# EAGLE design PartiBadge-v3 (EAGLE 9.1.3)
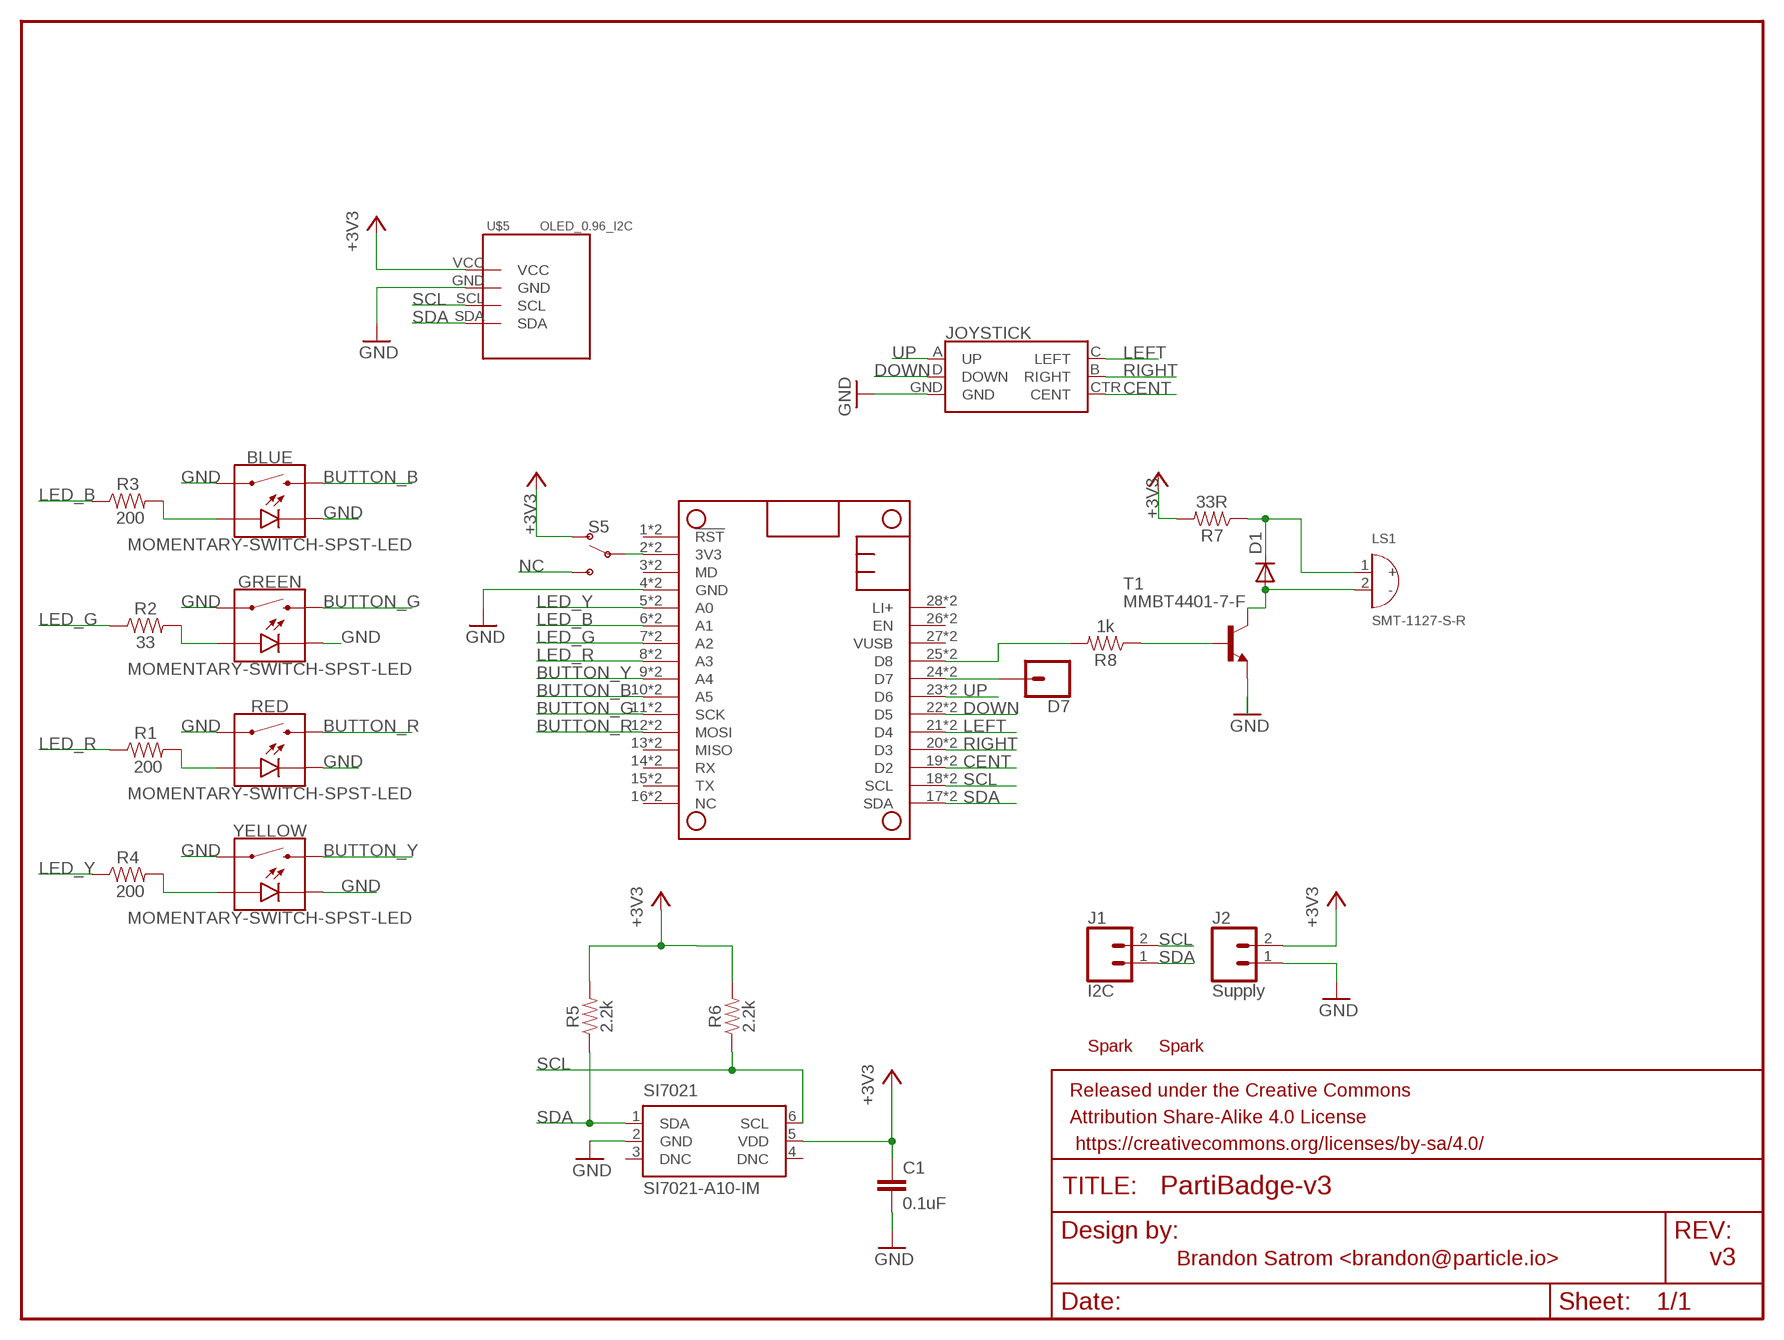
[diagram p0: schematic, sheet 1]

## Parts
BLUE  MOMENTARY-SWITCH-SPST-LED  MOMENTARY-SWITCH-SPST-LED-PTH-12MM-KIT  [TACTILE_SWITCH_LED_PTH_12MM_KIT]
C1  0.1uF  0.1UF-0603-25V-(+80/-20%)  [0603]
D1  DIODE-SOD323-W  [SOD323-W]
D7  CONN_01  [1X01]
GREEN  MOMENTARY-SWITCH-SPST-LED  MOMENTARY-SWITCH-SPST-LED-PTH-12MM-KIT  [TACTILE_SWITCH_LED_PTH_12MM_KIT]
J1  I2C  CONN_02  [1X02]
J2  Supply  CONN_02  [1X02]
JOYSTICK  JOYSTICK_MINI  [JOYSTICK_MINI]
LS1  SMT-1127-S-R  [XDCR_SMT-1127-S-R]
MS1  PARTICLE_MESH_SMTDUAL  [FEATHERWING_SMT2]
PARTIFRAME  FRAME-LETTERNO_PACKAGE  [DUMMY]
R1  200  RESISTOR1206  [1206]
R2  33  RESISTOR1206  [1206]
R3  200  RESISTOR1206  [1206]
R4  200  RESISTOR1206  [1206]
R5  2.2k  4.7KOHM-0603-1/10W-1%  [0603]
R6  2.2k  4.7KOHM-0603-1/10W-1%  [0603]
R7  33R  10KOHM-0603-1/10W-1%  [0603]
R8  1k  10KOHM-0603-1/10W-1%  [0603]
RED  MOMENTARY-SWITCH-SPST-LED  MOMENTARY-SWITCH-SPST-LED-PTH-12MM-KIT  [TACTILE_SWITCH_LED_PTH_12MM_KIT]
S5  SWITCH-SPDT-PTH-11.6X4.0MM  [SWITCH_SPDT_PTH_11.6X4.0MM]
SI7021  SI7021-A10-IM  [DFN6-3X3]
T1  MMBT4401-7-F  MMBT4401LT1-NPN-SOT23-BEC  [SOT23-BEC]
U$1  SPARK_LOGO_WITH_PLANE  [SPARK_LOGO_PLUS_PLANE]
U$2  SPARK_LOGO_WITH_PLANE  [SPARK_LOGO_PLUS_PLANE]
U$5  OLED_0.96_I2C  [OLED_0.96_I2C]
YELLOW  MOMENTARY-SWITCH-SPST-LED  MOMENTARY-SWITCH-SPST-LED-PTH-12MM-KIT  [TACTILE_SWITCH_LED_PTH_12MM_KIT]

## Nets
3V3: MS1.2'(3V3) MS1.2(3V3) S5.2(P)
+3V3: C1.1 J2.2 R5.2 R6.2 R7.2 S5.1(O) SI7021.5(VDD) U$5.VCC
BUTTON_B: BLUE.2 MS1.10'(A5) MS1.10(A5)
BUTTON_G: GREEN.2 MS1.11'(SCK) MS1.11(SCK)
BUTTON_R: MS1.12'(MOSI) MS1.12(MOSI) RED.2
BUTTON_Y: MS1.9'(A4) MS1.9(A4) YELLOW.2
CENT: JOYSTICK.CTR(CENT) MS1.19'(D2) MS1.19(D2)
DOWN: JOYSTICK.D(DOWN) MS1.22'(D5) MS1.22(D5)
GND: BLUE.4 BLUE.C C1.2 GREEN.4 GREEN.C J2.1 JOYSTICK.GND MS1.4'(GND) MS1.4(GND) RED.4 RED.C SI7021.2(GND) T1.E U$5.GND YELLOW.4 YELLOW.C
LED_B: MS1.6'(A1) MS1.6(A1) R3.1
LED_G: MS1.7'(A2) MS1.7(A2) R2.1
LED_R: MS1.8'(A3) MS1.8(A3) R1.1
LED_Y: MS1.5'(A0) MS1.5(A0) R4.1
LEFT: JOYSTICK.C(LEFT) MS1.21'(D4) MS1.21(D4)
N$1: D7.1 MS1.24'(D7) MS1.24(D7)
N$3: MS1.25'(D8) MS1.25(D8) R8.2
N$4: R1.2 RED.A
N$5: R8.1 T1.B
N$7: GREEN.A R2.2
N$8: BLUE.A R3.2
N$10: R4.2 YELLOW.A
N$18: D1.A LS1.2(-) T1.C
N$20: D1.C LS1.1(+) R7.1
NC: S5.3(S)
RIGHT: JOYSTICK.B(RIGHT) MS1.20'(D3) MS1.20(D3)
SCL: J1.2 MS1.18'(SCL) MS1.18(SCL) R6.1 SI7021.6(SCL) U$5.SCL
SDA: J1.1 MS1.17'(SDA) MS1.17(SDA) R5.1 SI7021.1(SDA) U$5.SDA
UP: JOYSTICK.A(UP) MS1.23'(D6) MS1.23(D6)
Unconnected: MS1.1'(!RST) MS1.1(!RST) MS1.3'(MD) MS1.3(MD) MS1.13'(MISO) MS1.13(MISO) MS1.14'(RX) MS1.14(RX) MS1.15'(TX) MS1.15(TX) MS1.16'(NC) MS1.16(NC) MS1.26'(EN) MS1.26(EN) MS1.27'(VUSB) MS1.27(VUSB) MS1.28'(LI+) MS1.28(LI+) SI7021.3(DNC) SI7021.4(DNC)

## Notes on the sheet
- Brandon Satrom <brandon@particle.io> | v3

## Library data of the parts
BLUE GREEN RED YELLOW = SparkFun-Switches:MOMENTARY-SWITCH-SPST-LED: Momentary Switch (Pushbutton) - SPST - w/ LED Normally-open (NO) SPST momentary switches (buttons, pushbuttons), with a built-in LED. Variants PTH-CHERRY - Cherry MX Switch Cherry MX Keyswitches are top-of-the-line mechanical keyboard switches. They’re satisfyingly “clicky”, reliable up to tens-of-millions of key presses, and a standard in gaming and programming keyboards across the globe. This ‘blue’ version Cherry MX Switch is favored by most due to its secondary internal actuator making it less likely to “double-tap.” If you are looking for a noticeably audible and high-quality key switch, this is the perfect option for you! Cherry MX Switch <https://www.sparkfun.com/products/13834> (COM-13834) Cherry MX Switch Breakout <https://www.sparkfun.com/products/13773> (BOB-13773) PTH-12MM and PTH-12MM-KIT - 12mm Illuminated LED KIT variant is for soldering kits. There is no tStop (covering up the top side of the pads with mask). This helps the beginner see which side they should be soldering too. LED Tactile Button Breakout <https://www.sparkfun.com/products/10467> (BOB-10467) LED Tactile Button - Red <https://www.sparkfun.com/products/10442> (COM-10442) LED Tactile Button - Blue <https://www.sparkfun.com/products/10443> (COM-10443) LED Tactile Button - Green <https://www.sparkfun.com/products/10440> (COM-10440) LED Tactile Button - Orange <https://www.sparkfun.com/products/10441> (COM-10441) LED Tactile Button - White <https://www.sparkfun.com/products/10439> (COM-10439); PROD_ID: SWCH-11758; SF_SKU: COM-10442
C1 = SparkFun-Capacitors:0.1UF: 0.1µF ceramic capacitors A capacitor is a passive two-terminal electrical component used to store electrical energy temporarily in an electric field.; PROD_ID: CAP-00810
D1 = diode:DIODE-: DIODE
D7 = SparkFun-Connectors:CONN_01: Single connection point. Often used as Generic Header-pin footprint for 0.1 inch spaced/style header connections On any of the 0.1 inch spaced packages, you can populate with these: Break Away Headers - Straight <https://www.sparkfun.com/products/116> (PRT-00116) Break Away Male Headers - Right Angle <https://www.sparkfun.com/products/553> (PRT-00553) Female Headers <https://www.sparkfun.com/products/115> (PRT-00115) Break Away Headers - Machine Pin <https://www.sparkfun.com/products/117> (PRT-00117) Break Away Female Headers - Swiss Machine Pin <https://www.sparkfun.com/products/743> (PRT-00743) This device is also useful as a general connection point to wire up your design to another part of your project. Our various solder wires solder well into these plated through hole pads. Hook-Up Wire - Assortment (Stranded, 22 AWG) <https://www.sparkfun.com/products/11375> (PRT-11375) Hook-Up Wire - Assortment (Solid Core, 22 AWG) <https://www.sparkfun.com/products/11367> (PRT-11367) View the entire wire category on our website here <https://www.sparkfun.com/categories/141> Special notes: SMTSO-256-ET is a "flush mount" nut for a 4-40 screw. We mostly use this on specialty testbeds; it is a nice way to connect hardware to your PCB at an adjustable hieght. Also note, the SNAP packages are for using a snappable style connector. We sell a baggie of snaps and they are also used on two LilyPad designs: Snap Assortment - 30 pack (male and female) <https://www.sparkfun.com/products/11347> (DEV-11347) LilyPad Arduino SimpleSnap <https://www.sparkfun.com/products/10941> (DEV-10941) LilyPad SimpleSnap Protoboard <https://www.sparkfun.com/products/10940> (DEV-10940)
J1 J2 = SparkFun-Connectors:CONN_02: Multi connection point. Often used as Generic Header-pin footprint for 0.1 inch spaced/style header connections On any of the 0.1 inch spaced packages, you can populate with these: Break Away Headers - Straight <https://www.sparkfun.com/products/116> (PRT-00116) Break Away Male Headers - Right Angle <https://www.sparkfun.com/products/553> (PRT-00553) Female Headers <https://www.sparkfun.com/products/115> (PRT-00115) Break Away Headers - Machine Pin <https://www.sparkfun.com/products/117> (PRT-00117) Break Away Female Headers - Swiss Machine Pin <https://www.sparkfun.com/products/743> (PRT-00743) For SCREWTERMINALS and SPRING TERMINALS visit here: Screw Terimnals on SparkFun.com <https://www.sparkfun.com/search/results?term=Screw+Terminals> (5mm/3.5mm/2.54mm spacing) This device is also useful as a general connection point to wire up your design to another part of your project. Our various solder wires solder well into these plated through hole pads. Hook-Up Wire - Assortment (Stranded, 22 AWG) <https://www.sparkfun.com/products/11375> (PRT-11375) Hook-Up Wire - Assortment (Solid Core, 22 AWG) <https://www.sparkfun.com/products/11367> (PRT-11367) View the entire wire category on our website here <https://www.sparkfun.com/categories/141> Special notes: Molex polarized connector foot print use with: PRT-08233 with associated crimp pins and housings. 2.54_SCREWTERM for use with PRT-10571. 3.5mm Screw Terminal footprints for PRT-08084 5mm Screw Terminal footprints for use with PRT-08432
JOYSTICK = SparkFun-Switches:JOYSTICK_MINI: Small Tactile Joystick w/ Select Switch A 5-way tactile switch allows for a joystick-like interface in a very small package. Part #: 4UCON SF303GJ26 SparkFun Products 5-way Tactile Switch <https://www.sparkfun.com/products/10063> (COM-10063) Used on SparkFun Block for Intel® Edison - OLED <https://www.sparkfun.com/products/13035> (DEV-13035) Used on CAN-BUS Shield <https://www.sparkfun.com/products/13262> (DEV-13262); PROD_ID: SWCH-09905; SF_SKU: COM-10063
LS1 = SMT-1127-S-R:SMT-1127-S-R: Audio Indicator Transducer Electromagnetic 3.6Vpk 100mA Solder Pad 2.5Vpk 2231Hz to 3231Hz Surface Mount; DESCRIPTION: Audio Indicator Transducer Electromagnetic 3.6Vpk 100mA Solder Pad 2.5Vpk 2231Hz to 3231Hz Surface Mount; DIGI-KEY_PART_NUMBER: 668-1480-1-ND; DIGI-KEY_PURCHASE_URL: https://www.digikey.com/product-detail/en/pui-audio-inc/SMT-1127-S-R/668-1480-1-ND/5011417?utm_source=snapeda&utm_medium=aggregator&utm_campaign=symbol; MF: PUI; MP: SMT-1127-S-R; PACKAGE: PUI
MS1 = Particle-Mesh:PARTICLE_MESH
PARTIFRAME = SparkFun-Aesthetics:FRAME-LETTER: Schematic Frame - Letter Standard 8.5x11 US Letter frame; DESIGNER: Brandon Satrom; VERSION: v01
R1-R4 = SparkFun-Resistors:RESISTOR: Generic Resistor Package
R5 R6 = SparkFun-Resistors:4.7KOHM: 4.7kΩ resistor A resistor is a passive two-terminal electrical component that implements electrical resistance as a circuit element. Resistors act to reduce current flow, and, at the same time, act to lower voltage levels within circuits. - Wikipedia; PROD_ID: RES-07857; VALUE: 4.7k
R7 R8 = SparkFun-Resistors:10KOHM: 10kΩ resistor A resistor is a passive two-terminal electrical component that implements electrical resistance as a circuit element. Resistors act to reduce current flow, and, at the same time, act to lower voltage levels within circuits. - Wikipedia; PROD_ID: RES-00824; VALUE: 10k
S5 = SparkFun-Switches:SWITCH-SPDT: Single Pole, Double Throw (SPDT) Switch Single-pole, double-throw (SPDT) switch. Variant Overview SMD-AYZ0202 Surface Mount DPDT Switch <https://www.sparkfun.com/products/597> (COM-00597) Used on e.g. LilyPad Arduino USB - ATmega32U4 Board <https://www.sparkfun.com/products/12049> PTH-11.6X4.0MM SPDT Mini Power Switch <https://www.sparkfun.com/products/102> (COM-00102) Used on e.g. SparkFun Simon Says - Through-Hole Soldering Kit <https://www.sparkfun.com/products/10547> (KIT-10547) PTH-11.6X4.0MM-KIT KIT version of SPDT Mini Power Switch - Simplifies soldering by removing tStop of switch pins - only one side can be soldered. PTH-11.6X4.0MM-LOCK LOCK version of SPDT Mini Power Switch - Offset pins hold switch in place for easier soldering. SMD-RIGHT-ANGLE Surface Mount Right Angle Switch <https://www.sparkfun.com/products/10860> (COM-10860) Used on e.g. SparkFun ESP8266 Thing <https://www.sparkfun.com/products/13231>; PROD_ID: SWCH-08261; SF_SKU: COM-00102
SI7021 = si70xx-10:SI7021-*: I2C Humidity and Temperature Sensor Source: http://www.silabs.com/Support%20Documents/TechnicalDocs/Si7021.pdf; MF: Silicon Labs; MPN: Si7021-A10-IM; OC_FARNELL: 2422573; OC_NEWARK: 55X3113
T1 = transistor:*-NPN-: NPN Transistror BF959 corrected 2008.03.06
U$1 U$2 = Spark:SPARK_LOGO_WITH_PLANE
U$5 = tft_1.8_1.44_oled_0.96:OLED_0.96_I2C

## Board
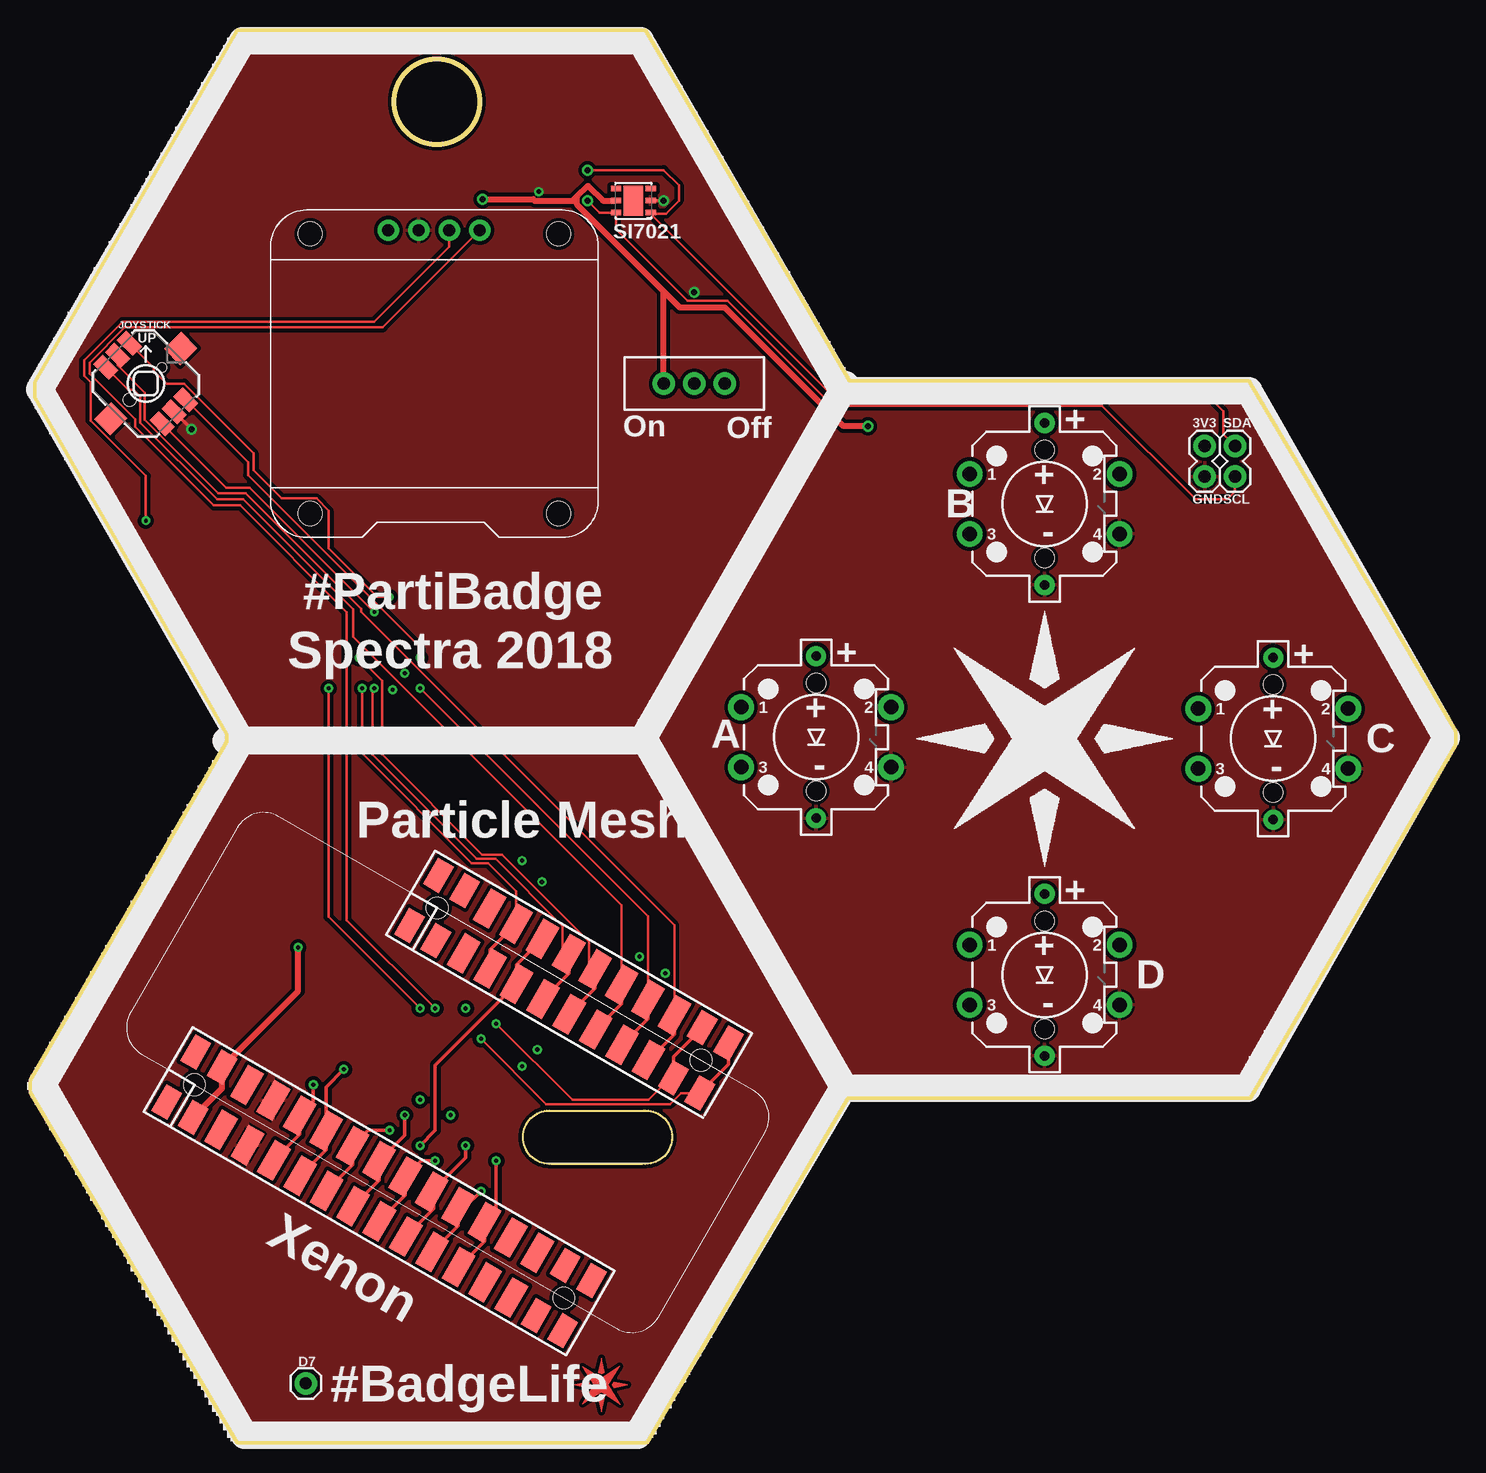
[diagram p1: board, top side]
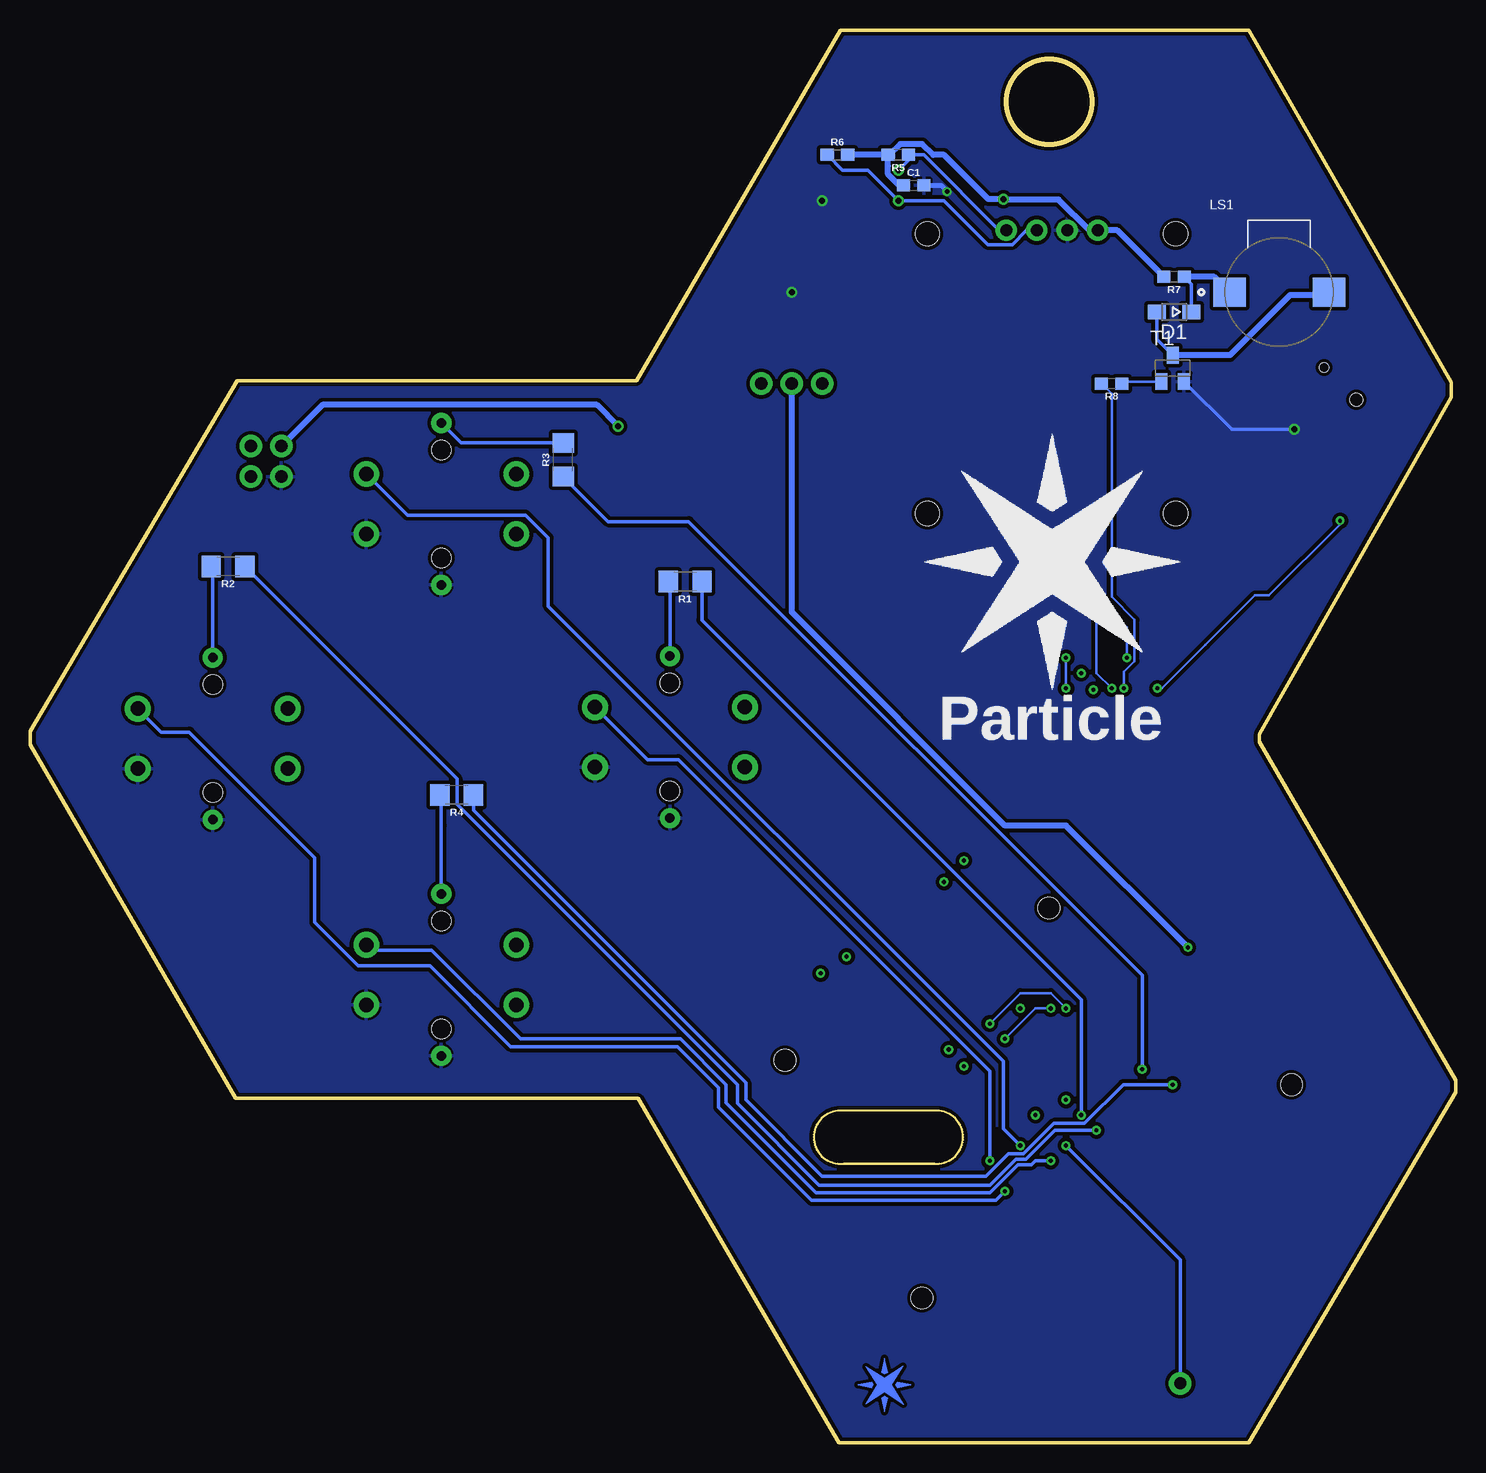
[diagram p2: board, bottom side, seen from below]

Size 118.87 x 117.73 mm. Coordinates in mm from the lower left corner, seen from the top.
Outline: 43.31,27.69 51.18,27.69 51.31,27.69
Outline: 43.43,23.24 51.05,23.24
Outline: 43.31,27.69 51.31,27.69
Outline: 51.31,27.69 arc-180 51.31,23.24 43.31,23.24 arc-180 43.31,27.69
Outline: 16.38,59.05 0.38,87.12 0.38,88.39 17.27,117.73 51.31,117.73 68.33,88.52 101.6,88.52 118.87,59.31 118.87,58.17 101.73,28.7 68.2,28.7 51.44,0 17.27,0 0,29.21 0,30.23 16.38,58.42 16.38,59.05
Outline: circle at 33.91,111.76 radius 3.56
Copper layers (1+2*15+16): Top 0.018mm / dielectric 0.195mm / Route2 0.035mm / dielectric 1.1mm / Route15 0.035mm / dielectric 0.195mm / Bottom 0.018mm
Design rules "spark-4layer": minimum track width 6mil, minimum drill 0.3mm, track to track 6mil, track to pad 6mil, pad to pad 6mil, via to via 6mil, smd to smd 6mil, copper to edge 6mil, drill to drill 6mil, minimum pad ring 12mil, minimum via ring 8mil, stop-mask expansion 4mil, vias tented up to drill 20mil, thermal gap 8mil

### Footprints (pad centres in the part's own frame; a part is rotated, then mirrored left to right if it is on the bottom)
TACTILE_SWITCH_LED_PTH_12MM_KIT = drill 1.2 pad 2.159: 1 -6.25,2.5; 2 6.25,2.5; 3 -6.25,-2.5; 4 6.25,-2.5 | drill 0.8 pad 1.676: A 0,6.75; C 0,-6.75 | hole 1.6: 0,4.5; 0,-4.5
0603 = smd 1.1 x 1: 1 -0.85,0; 2 0.85,0
SOD323-W = smd 1.5 x 1.2: A 1.45,0; C -1.45,0
1X01 = drill 1.016 pad 1.88: 1 0,0
1X02 = drill 1.016 pad 1.88: 1 0,0; 2 2.54,0
JOYSTICK_MINI = smd 1.85 x 1.1: A -3.325,1.4; B 3.325,1.4; C -3.325,-1.4; CTR -3.325,0; D 3.325,-1.4; GND 3.325,0 | smd 1.9 x 2: NC 0,4.13; NC@0 0,-4.13 | hole 0.75: 0,1.9 | hole 1.05: 0,-1.9
XDCR_SMT-1127-S-R = smd 2.71 x 2.41: 1 -4.15,0; 2 4.15,0
FEATHERWING_SMT2 = smd 1.524 x 2.54: 1 6.35,2.413; 1' 6.35,-2.413; 2 8.89,2.413; 2' 8.89,-2.413; 15 41.91,2.413; 15' 41.91,-2.413; 16 44.45,2.413; 16' 44.45,-2.413; 17 44.45,20.447; 17' 44.45,25.273; 18 41.91,20.447; 18' 41.91,25.273; 27 19.05,20.447; 27' 19.05,25.273; 28 16.51,20.447; 28' 16.51,25.273 | smd 1.524 x 3.048: 3 11.43,2.159; 3' 11.43,-2.159; 4 13.97,2.159; 4' 13.97,-2.159; 5 16.51,2.159; 5' 16.51,-2.159; 6 19.05,2.159; 6' 19.05,-2.159; 7 21.59,2.159; 7' 21.59,-2.159; 8 24.13,2.159; 8' 24.13,-2.159; 9 26.67,2.159; 9' 26.67,-2.159; 10 29.21,2.159; 10' 29.21,-2.159; 11 31.75,2.159; 11' 31.75,-2.159; 12 34.29,2.159; 12' 34.29,-2.159; 13 36.83,2.159; 13' 36.83,-2.159; 14 39.37,2.159; 14' 39.37,-2.159; 19 39.37,20.701; 19' 39.37,25.019; 20 36.83,20.701; 20' 36.83,25.019; 21 34.29,20.701; 21' 34.29,25.019; 22 31.75,20.701; 22' 31.75,25.019; 23 29.21,20.701; 23' 29.21,25.019; 24 26.67,20.701; 24' 26.67,25.019; 25 24.13,20.701; 25' 24.13,25.019; 26 21.59,20.701; 26' 21.59,25.019 | hole 1.8: 17.78,22.86; 43.18,22.86; 7.62,0; 43.18,0
1206 = smd 1.6 x 1.8: 1 -1.4,0; 2 1.4,0
SWITCH_SPDT_PTH_11.6X4.0MM = drill 1.016 pad 1.88: 1 0,2.54; 2 0,0; 3 0,-2.54
DFN6-3X3 = smd 0.85 x 0.45: 1 -1.45,1; 2 -1.45,0; 3 -1.45,-1; 4 1.45,-1; 5 1.45,0; 6 1.45,1 | smd 1.6 x 2.5: EXP 0,0
SOT23-BEC = smd 1 x 1.4: B -0.95,-1.1; C 0,1.1; E 0.95,-1.1
OLED_0.96_I2C = drill 1 pad 1.778: GND -1.63,11.63; SCL 0.91,11.63; SDA 3.45,11.63; VCC -4.17,11.63 | hole 2: -10.67,-11.97; 10.03,-11.97; 10.03,11.33; -10.67,11.33

### Placement (x,y rotation side)
BLUE  84.58,78.23 0 top
C1  45.21,104.78 0 bottom
D1  23.49,94.23 180 bottom
D7  22.99,4.95 0 top
GREEN  103.63,58.67 0 top
J1  100.46,83.06 270 top
J2  97.92,80.52 90 top
JOYSTICK  9.65,88.27 315 top
LS1  14.73,95.89 0 bottom
MS1  7.11,33.66 330 top
PARTIFRAME  -4.32,-3.17 0 bottom  (outside the outline)
R1  64.26,71.76 180 bottom
R2  102.36,73.03 180 bottom
R3  74.42,81.92 90 bottom
R4  83.31,53.98 180 bottom
R5  46.48,107.31 180 bottom
R6  51.56,107.31 0 bottom
R7  23.49,97.16 180 bottom
R8  28.7,88.27 180 bottom
RED  65.53,58.8 0 top
S5  55.37,88.27 90 top
SI7021  50.29,103.51 180 top
T1  23.62,89.53 0 bottom
U$1  47.62,4.83 0 top
U$2  47.62,4.83 0 bottom
U$3  [MESH#1PX#SVG]  59.18,59.05 0 top
U$4  [SPARK-LOGO]  33.66,73.41 0 bottom
U$5  34.04,89.41 0 top
U$6  [SPARK-LOGO]  84.58,58.67 0 top
YELLOW  84.58,38.99 0 top

### Tracks (layer width: path | path; a pad name or v marks a point on that pad's centre or on a via)
3V3  (via drill 0.35)
  Top 0.508: v22.35,41.28 22.35,37.63 MS1.2 16.02,29.53 MS1.2'
  Bottom 0.508: v22.35,41.28 32.51,51.44 37.59,51.44 55.37,69.22 S5.2
+3V3  (via drill 0.5)
  Top 0.508: SI7021.5 47.75,103.51 46.54,104.72 46.48,104.72 45.62,103.86 | 52.86,95.91 45.62,103.15 45.62,103.86 | 52.86,95.91 54.16,94.62 | 54.16,94.62 57.91,94.62 67.82,84.71 v69.85,84.71 | v37.72,103.63 41.94,103.63 42.09,103.48 45.24,103.48 45.62,103.86 | 54.16,94.62 | S5.1 52.83,95.89 52.86,95.91
  Bottom 0.305: 50.55,107.48 R6.2
  Bottom 0.508: J2.2 94.49,86.48 71.62,86.48 v69.85,84.71 | R5.2 47.26,107.31 46.35,108.22 44.48,108.22 43.57,107.31 42.67,107.31 38.99,103.63 v37.72,103.63 37.69,103.6 33.14,103.6 30.57,101.04 U$5.VCC 28.23,101.04 R7.2 | R5.2 50.38,107.31 50.55,107.48 | R5.2 47.33,106.41 47.34,106.4 47.34,105.69 46.43,104.78 C1.1
BUTTON_B  (via drill 0.35)
  Top 0.305: v36.32,24.77 36.32,23.75 33.65,21.08 | 33.65,21.08 MS1.10 | MS1.10' 33.65,19.5 33.65,21.08
  Bottom 0.305: BLUE.2 87.4,77.3 77.56,77.3 75.68,75.42 75.68,69.72 37.74,31.79 37.74,26.18 v36.32,24.77
BUTTON_G  (via drill 0.35)
  Top 0.305: v37.59,20.95 36.29,19.65 MS1.11 35.69,18.07 MS1.11'
  Bottom 0.305: GREEN.2 107.92,59.22 105.59,59.22 95.14,48.77 95.14,43.36 91.51,39.73 85.51,39.73 78.79,33.02 65.53,33.02 64.9,33.02 61.47,29.59 61.47,27.94 53.72,20.19 38.86,20.19 38.35,20.19 v37.59,20.95
BUTTON_R  (via drill 0.35)
  Top 0.305: v38.86,23.5 38.86,19.35 MS1.12 37.89,16.8 MS1.12'
  Bottom 0.305: RED.2 67.41,56.93 64.82,56.93 38.86,30.97 v38.86,23.5
BUTTON_Y  (via drill 0.35)
  Top 0.305: v33.78,23.5 32.59,23.5 MS1.9 31.29,20.61 MS1.9'
  Bottom 0.305: YELLOW.2 90.4,41.05 85.39,41.05 78,33.66 64.64,33.66 60.83,29.85 60.83,28.32 53.34,20.83 38.86,20.83 38.68,21.01 38.67,21.01 36.51,23.17 35.38,23.17 35.05,23.5 v33.78,23.5
CENT
  Top 0.203: JOYSTICK.CTR 7.3,89.77 9.56,87.51 9.56,85.24 15.68,79.12 17.96,79.12 27.59,69.5 27.59,69.24 53.72,43.11 MS1.19'
  Top 0.305: MS1.19 53.72,34.06 MS1.19'
DOWN  (via drill 0.3, 0.35)
  Top 0.203: JOYSTICK.D 16.35,79.59 18.33,79.59 v28.7,69.22 | MS1.22' 46.61,39.95 46.61,41.77 39.37,49.02 37.68,49.02 29.34,57.36 29.34,63.5 v27.43,65.41
  Top 0.305: MS1.22 47.12,37.87 MS1.22'
  Bottom 0.203: v27.43,65.41 27.43,67.95 v28.7,69.22
GND  (via drill 0.35, 0.5)
  Top 0.305: JOYSTICK.GND v13.46,84.45 | v13.46,84.45 | SI7021.2 v52.83,103.51
  Bottom 0.305: v13.46,84.45 18.69,84.45 T1.E
  Bottom 0.406: C1.2 42.93,104.78 v42.42,104.27
  other vias: 55.37,95.89
  pour Bottom (isolate 0.305): 14.73,120.02 51.56,120.02 106.17,88.27 127.76,51.44 70.61,-4.45 18.54,-4.45 -4.32,29.85 -4.32,88.27
  pour Top (isolate 0.305): 0.03,120.02 78.23,120.02 121.41,76.84 118.87,24.77 51.56,-1.9 16,-1.9 -4.99,30.9
LED_B  (via drill 0.35)
  Top 0.305: v26.16,31.11 24.69,29.64 MS1.6 24.69,24.42 MS1.6'
  Bottom 0.305: R3.1 70.68,76.77 63.97,76.77 26.16,38.96 v26.16,31.11
LED_G  (via drill 0.35)
  Top 0.305: v29.97,26.04 28.19,26.04 MS1.7 26.89,23.15 MS1.7'
  Bottom 0.305: R2.1 83.27,55.33 83.27,53.2 60.18,30.11 59.91,29.85 59.91,28.29 53.09,21.46 38.86,21.46 | 38.86,21.46 | v29.97,26.04 33.44,26.04 35.85,23.62 36.7,23.62 38.86,21.46
LED_R  (via drill 0.35)
  Top 0.305: v31.24,27.3 31.24,25.61 MS1.8 29.09,21.88 MS1.8'
  Bottom 0.305: R1.1 62.86,68.55 31.24,36.93 v31.24,27.3
LED_Y  (via drill 0.35)
  Top 0.305: v23.62,29.85 23.62,28.4 MS1.5 22.49,25.69 MS1.5'
  Bottom 0.305: R4.1 81.91,52.71 59.2,30 59.2,28.6 52.83,22.22 39.17,22.22 37.31,24.08 36.04,24.08 33.5,26.62 30.96,26.62 27.74,29.85 v23.62,29.85
LEFT
  Top 0.203: JOYSTICK.C 8.19,87.75 8.65,87.75 9.21,87.2 9.21,85 15.6,78.61 17.78,78.61 26.95,69.44 26.95,67.16 49.32,44.79 MS1.21'
  Top 0.305: MS1.21 49.32,36.6 MS1.21'
N$1  (via drill 0.35)
  Top 0.305: MS1.24' 40.56,39.83 MS1.24 33.78,31.47 33.78,26.04 v32.51,24.77
  Bottom 0.305: v32.51,24.77 22.99,15.24 D7.1
N$2  (via drill 0.35)
  other vias: 31.24,64.14
N$3  (via drill 0.35)
  Top 0.203: MS1.25' 40.52,45.97 38.18,48.3 36.83,48.3 27.69,57.45 v27.69,62.87
  Top 0.305: MS1.25 38.36,41.1 MS1.25'
  Bottom 0.203: v27.69,62.87 27.69,64.26 26.8,65.14 26.8,68.58 28.7,70.48 28.7,87.42 R8.2
N$4
  Bottom 0.305: RED.A 65.53,71.62 R1.2
N$5
  Bottom 0.203: T1.B 27.68,88.44 R8.1
  Bottom 0.254: 27.68,88.44 R8.1
N$6  (via drill 0.35)
  other vias: 30.23,62.74
N$7
  Bottom 0.305: GREEN.A 103.63,72.89 R2.2
N$8
  Bottom 0.305: R3.2 74.44,83.33 82.93,83.33 BLUE.A
N$9  (via drill 0.35)
  other vias: 41.02,48.51
N$10
  Bottom 0.305: YELLOW.A 84.58,51.44 84.58,53.85 R4.2
N$11  (via drill 0.35)
  other vias: 42.67,46.74
N$12  (via drill 0.35)
  other vias: 50.8,40.51
N$13  (via drill 0.35)
  other vias: 52.96,39.12
N$14  (via drill 0.35)
  other vias: 41.02,31.37
N$15  (via drill 0.35)
  other vias: 42.29,32.77
N$16  (via drill 0.35)
  other vias: 35.05,27.3
N$17  (via drill 0.35)
  other vias: 32.51,28.57
N$18
  Bottom 0.305: T1.C 24.95,91.96 D1.A
  Bottom 0.508: LS1.2 10.84,95.63 13.84,95.63 18.84,90.64 T1.C
N$19  (via drill 0.35)
  other vias: 36.32,36.2
N$20
  Bottom 0.305: D1.C 22.05,96.56 R7.1
  Bottom 0.508: LS1.1 20.15,97.16 R7.1
RIGHT  (via drill 0.35)
  Top 0.203: JOYSTICK.B 18.17,81.72 18.17,80.64 32.51,66.31 v32.51,65.41 | MS1.20' 51.52,43.86 v32.51,62.87
  Top 0.305: MS1.20 51.52,35.33 MS1.20'
  Bottom 0.203: v32.51,62.87 v32.51,65.41
SCL  (via drill 0.3, 0.35, 0.5)
  Top 0.203: v46.48,103.51 47.48,102.51 SI7021.6 48.84,101.14 54.81,95.17 58.14,95.17 66.88,86.43 89.37,86.43 97.17,78.64 99.83,78.64 100.46,79.27 J1.2 | U$5.SCL 34.95,99.66 28.7,93.41 7.71,93.41 4.51,90.21 4.51,88.9 5.05,88.36 5.05,85.18 9.65,80.58 v9.65,76.84 | MS1.18 53.4,30.41 51.56,28.57 45.21,28.57 v38.86,34.93 | v32.51,36.2 24.89,43.82 v24.89,62.87
  Top 0.305: MS1.18 53.63,32.17 MS1.18'
  Bottom 0.203: v9.65,76.84 9.65,76.54 15.58,70.61 16.76,70.61 20.89,66.48 24.51,62.87 v24.89,62.87 | v38.86,34.93 36.32,37.47 33.78,37.47 v32.51,36.2
  Bottom 0.305: R6.1 51.14,106.05 49.02,106.05 v46.48,103.51 42.67,103.51 39.01,99.84 36.99,99.84 35.8,101.04 U$5.SCL
SDA  (via drill 0.35, 0.5)
  Top 0.203: v46.48,106.05 52.83,106.05 54.1,104.78 54.1,103.51 53.03,102.44 51.74,102.44 67.16,87.01 98.42,87.01 99.46,85.98 99.46,84.06 J1.1 | U$5.SDA 29.4,92.95 7.9,92.95 4.96,90.02 4.96,89.09 8.75,85.31 8.75,84.68 15.33,78.11 17.53,78.11 26.42,69.22 26.42,43.56 v33.78,36.2 | MS1.17 54.25,29.14 53.33,28.22 43.03,28.22 v37.59,33.66
  Top 0.305: 51.74,102.44 SI7021.1 | MS1.17 58.24,31.55 MS1.17'
  Bottom 0.203: v37.59,33.66 35.05,36.2 v33.78,36.2
  Bottom 0.305: v46.48,106.05 45.63,106.89 R5.1 44.36,107.31 38.09,101.04 U$5.SDA
UP  (via drill 0.3, 0.35)
  Top 0.203: JOYSTICK.A 10.32,89.58 10.32,89.33 11.39,88.25 12.85,88.25 18.63,82.47 18.63,81.03 20.97,78.69 23.88,78.69 24.89,77.69 24.89,74.55 28.96,70.48 v29.97,70.48 | MS1.23' 44.41,41.22 44.41,43.04 38.79,48.66 37.23,48.66 28.58,57.31 28.58,62.74 v28.7,62.87
  Top 0.305: MS1.23 44.92,39.14 MS1.23'
  Bottom 0.203: v28.7,62.87 29.97,64.14 v29.97,70.48

### Text on the board
tPlace: 3V3 | SDA | On | Off | GND | SCL | B | #PartiBadge | Spectra 2018 | A | C | Particle Mesh | D | Xenon | #BadgeLife
bPlace: Particle
Document: *NON PLATED * / *SLOT*
Reference: NOTES: | 1. | MATERIAL: MAKE FROM EPOXY GLASS (NEMA-GR-FR4, | SOLDERMASK COLOR -- MATTE BLACK) | 2 LAYERS | 2. | PLATING: | ENIG GOLD | Layer Stackup: | Top Silkscreen | Top Soldermask | Top Copper (1 Oz.) | 0.062" FR4 | Bottom Copper (1 Oz.) | Bottom Soldermask | Bottom Silkscreen